# Altium schematic sheet two_ch.SchDoc
size A4
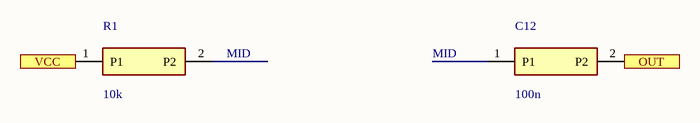
[diagram p0: two_ch.SchDoc]

## Parts
C12  100n
R1  10k

## Ports
OUT, VCC

## Nets
MID: C12.1(P1) R1.2(P2)
OUT: C12.2(P2) ; port OUT
VCC: R1.1(P1) ; port VCC

## Library data of the parts
C12 = CAP
R1 = RES